# Altium schematic sheet USB_UART.SchDoc
size A4; SheetNumber: 1; SheetTotal: 4
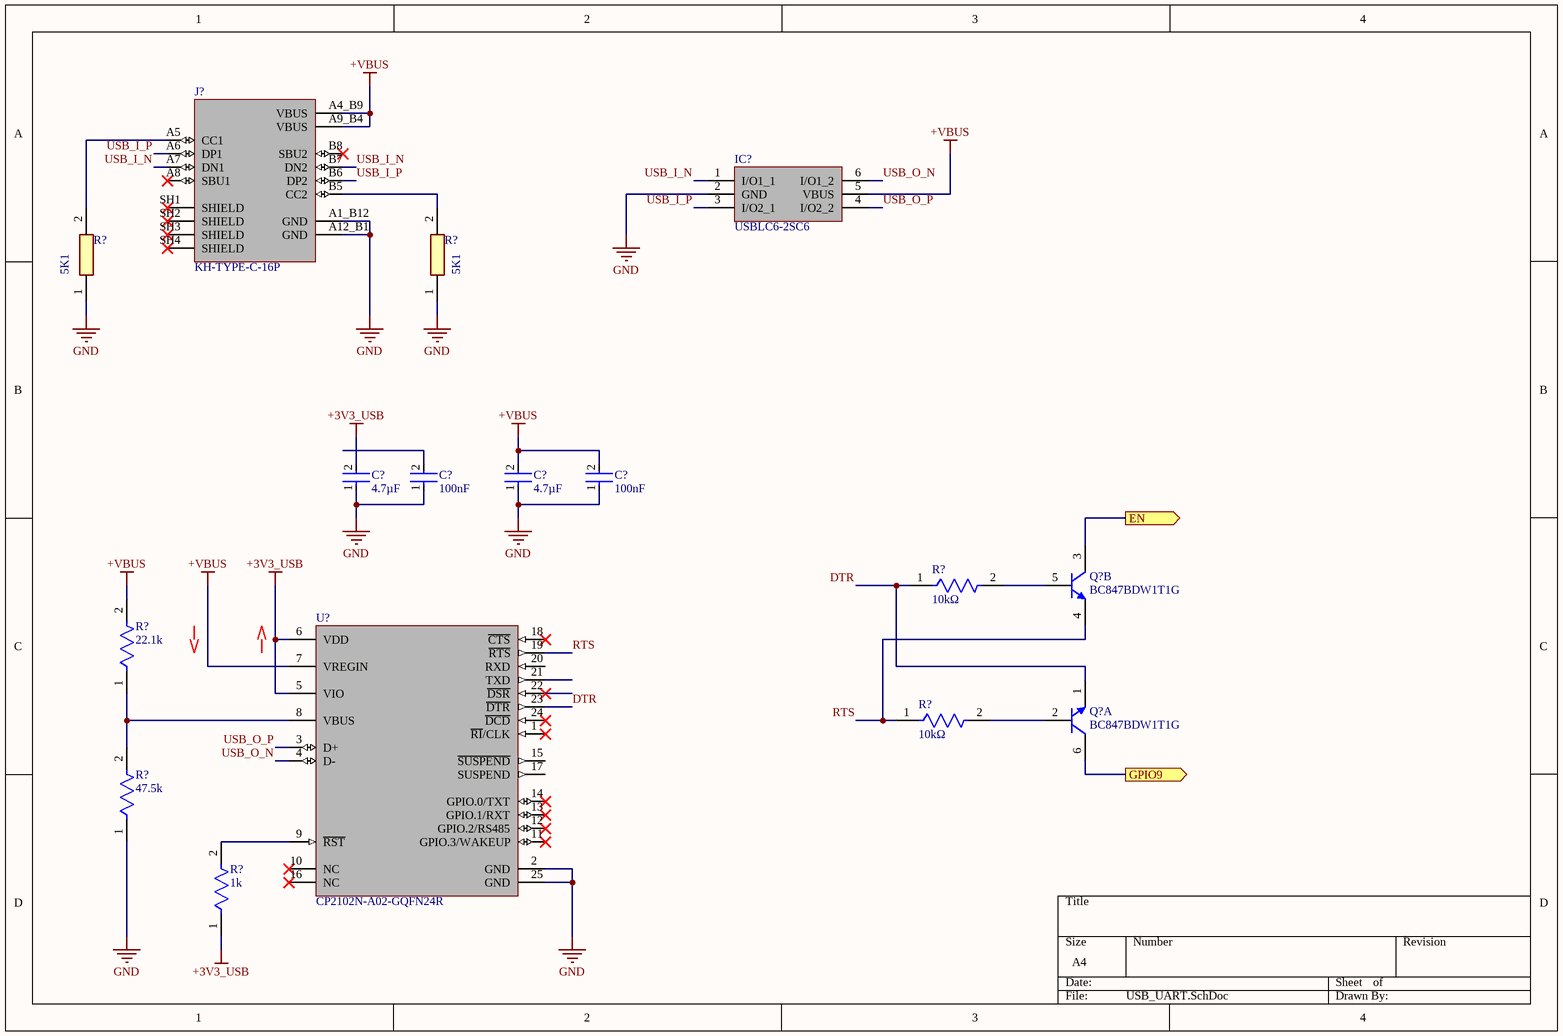
[diagram p0: USB_UART.SchDoc]

## Parts
(Parts that share a designator on the sheet are numbered #1, #2 ... from top to bottom, then left to right.)
C?#1  4.7µF  [FP-CGB3B-MFG]
C?#2  100nF  [FP-CGA3E-0_3-0_1-IPC_A]
C?#3  4.7µF  [FP-CGB3B-MFG]
C?#4  100nF  [FP-CGA3E-0_3-0_1-IPC_A]
IC?  USBLC6-2SC6  [Tech Public SOT23-6]
J?  KH-TYPE-C-16P  [KINGHELM_KH-TYPE-C-16P]
Q?#1  BC847BDW1T1G  [ONSC-SOT-363-6-419B-02_W_V]  (part B of 2)
Q?#2  BC847BDW1T1G  [ONSC-SOT-363-6-419B-02_W_V]  (part A of 2)
R?#1  5K1  [RESC1608X55N]
R?#2  5K1  [RESC1608X55N]
R?#3  10kΩ  [FP-RC0603-0_55-IPC_C]
R?#4  22.1k  [FP-AC0603-IPC_B]
R?#5  10kΩ  [FP-RC0603-0_55-IPC_C]
R?#6  47.5k  [FP-AC0603-IPC_B]
R?#7  1k  [FP-AC0603-IPC_B]
U?  CP2102N-A02-GQFN24R  [FP-CP2102N-A02-GQFN24R-IPC_C]

## Ports
EN (out), GPIO9 (out)

## Nets
+3V3_USB: C?#1.2 R?#7.1 U?.5(VIO) U?.6(VDD)
+VBUS: C?#3.2 C?#4.2 IC?.5(VBUS) J?.A4_B9(VBUS) J?.A9_B4(VBUS) R?#4.2 U?.7(VREGIN)
GND: C?#1.1 C?#2.1 C?#3.1 C?#4.1 IC?.2(GND) J?.A1_B12(GND) J?.A12_B1(GND) R?#1.1 R?#2.1 R?#6.1 U?.2(GND) U?.25(GND)
DTR: Q?#2.1(E) R?#3.1 U?.23(~{DTR})
EN: Q?#1.3(C) ; port EN
GPIO9: Q?#2.6(C) ; port GPIO9
RTS: Q?#1.4(E) R?#5.1 U?.19(~{RTS})
USB_I_N: IC?.1(I/O1_1) J?.A7(DN1) J?.B7(DN2)
USB_I_P: IC?.3(I/O2_1) J?.A6(DP1) J?.B6(DP2)
USB_O_N: IC?.6(I/O1_2) U?.4(D-)
USB_O_P: IC?.4(I/O2_2) U?.3(D+)
NetJ?_A5: J?.A5(CC1) R?#1.2
NetJ?_B5: J?.B5(CC2) R?#2.2
NetQ?#1_5: Q?#1.5(B) R?#3.2
NetQ?#2_2: Q?#2.2(B) R?#5.2
NetR?#4_1: R?#4.1 R?#6.2 U?.8(VBUS)
NetR?#7_2: R?#7.2 U?.9(~{RST})

Not connected (* = marked no-connect by the designer): C?#2 2; J? A8(SBU1)* B8(SBU2)* SH1(SHIELD)* SH2(SHIELD)* SH3(SHIELD)* SH4(SHIELD)*; U? 1(~{RI}/CLK)* 10(NC)* 11(GPIO.3/WAKEUP)* 12(GPIO.2/RS485)* 13(GPIO.1/RXT)* 14(GPIO.0/TXT)* 15(~{SUSPEND}) 16(NC)* 17(SUSPEND) 18(~{CTS})* 20(RXD) 21(TXD) 22(~{DSR})* 24(~{DCD})*

## Library data of the parts
C?#1 C?#3 = CMP-08246-002692-1: CAP CER 4.7UF 10V X5R 0603; Tolerance: 10%; Mount: Surface Mount; Weight: 7.1E-05oz; Case Code (Metric): 1608; Thickness: 0.022inch; Voltage Rating: 10V; Termination: SMD/SMT; Min Operating Temperature: -55°C; Package Quantity: 1; Case/Package: 0603; Capacitance: 4.7uF; RoHS Compliant: Yes; Packaging: Tape and Reel; Max Operating Temperature: 85°C; Width: 0.031inch; Series: CGB; Height: 0.55mm; Dielectric: X5R; Depth: 0.8mm; Case Code (Imperial): 0603; Length: 1.6mm; Lead Free: Lead Free; Voltage Rating (DC): 10V
C?#2 C?#4 = CMP-2000-07546-2: Cap Ceramic 100nF 50V X7R 10% Pad SMD 0603 +125°C Automotive T/R; Weight: 7.1E-05oz; Composition: Ceramic; Max Operating Temperature: 125°C; Termination: SMD/SMT; Dielectric: X7R; Length: 1.6mm; Package Quantity: 1; REACH SVHC: No SVHC; Lead Free: Lead Free; Case Code (Metric): 1608; Min Operating Temperature: -55°C; Packaging: Tape and Reel; Tolerance: 10%; Voltage Rating: 50V; Case Code (Imperial): 0603; Capacitance: 100nF; Case/Package: 0603; Voltage Rating (DC): 50V; Depth: 0.8mm; Radiation Hardening: No; Ratings: AEC-Q200; Mount: Surface Mount; Voltage: 50V; Thickness: 0.035inch; Width: 0.8mm; Height: 0.8mm
IC? = Tech Public USBLC6-2SC6: Integrated Circuit; Height: 1.45mm; Manufacturer_Name: Tech Public; Manufacturer_Part_Number: USBLC6-2SC6; Mouser Part Number: 511-USBLC6-2SC6; Arrow Part Number: USBLC6-2SC6; Arrow Price/Stock: https://www.arrow.com/en/products/usblc6-2sc6/stmicroelectronics?region=nac
J? = KH-TYPE-C-16P: MF: kinghelm; Value: *; SnapEDA_Link: https://www.snapeda.com/parts/KH-TYPE-C-16P/Ki/view-part/?ref=snap; MP: KH-TYPE-C-16P; Check_prices: https://www.snapeda.com/parts/KH-TYPE-C-16P/Ki/view-part/?ref=eda; Availability: Not in stock; Price: None; Package: None
Q?#1 Q?#2 = CMP-1048-00875-1: Dual General Purpose Transistors, NPN, 6-Pin SOT-363, Pb-Free, Tape and Reel; Manufacturer: On Semiconductor; fT Min (MHz): 100; IC Continuous (A): 0.1; Polarity: Dual NPN; ComponentLink3Description: Package Specification; PackageReference: SOT-363-6-419B-02_W; RoHS: TRUE; PackageVersion: Rev. W, 01/2006; Packing: Tape and Reel; Mounting Technology: Surface Mount; ComponentLink3URL: http://www.onsemi.com/pub_link/Collateral/NTJD4001N-D.PDF; ComponentLink2URL: http://www.onsemi.cn/pub_link/Collateral/BC846BDW1T1-D.PDF; ComponentLink2Description: Datasheet; ComponentLink1Description: Manufacturer URL; PartNumber: BC847BDW1T1G; DatasheetVersion: Rev. 9; PackageDescription: 6-Pin Small Outline Transistor, Body 2 x 1.25 mm, Pitch 0.65 mm; ComponentLink1URL: http://www.onsemi.com/
R?#1 R?#2 = 0603WAF5101T5E: Resistor; Manufacturer_Name: UNI-ROYAL(Uniroyal Elec); Datasheet Link: https://datasheet.lcsc.com/szlcsc/Uniroyal-Elec-0603WAF5101T5E_C23186.pdf; Height: 0.55mm; Manufacturer_Part_Number: 0603WAF5101T5E
R?#3 R?#5 = CMP-2100-03664-2: RES 10K OHM 1% 1/10W 0603; Voltage Rating: 75V; Voltage Rating (DC): 50V; Resistance: 10kR; Power Rating: 100mW; Temperature Coefficient: 100ppm/°C; Depth: 0.8mm; Termination: SMD/SMT; Resistor Type: Thick Film; Series: RC; Construction: Rectangular; Features: Moisture Resistant; Packaging: Tape and Reel; Min Operating Temperature: -55°C; Number of Terminations: 2; Lead Pitch: 0.3mm; RoHS Compliant: Yes; Case/Package: 0603; Resistance Tolerance: 1%; Military Standard: Not; Weight: 7.1E-05oz; Number of Pins: 2; Tolerance: 1%; Length: 1.6mm; Case Code (Imperial): 0603; Lead Free: Lead Free; Width: 0.8mm; Max Power Dissipation: 100mW; Height: 0.45mm; Max Operating Temperature: 155°C; Case Code (Metric): 1608; Size Code: 0603
R?#4 = CMP-2000-04828-3: RES 22.1kΩ 1.00% 0.1W 0603; Voltage Rating: 50V; Power Rating: 100mW; Tolerance: 1%; Temperature Coefficient: 100ppm/°C; Depth: 0.8mm; Case/Package: 0603; Size Code: 0603; Case Code (Metric): 1608; Height: 0.022inch; Series: AC; Width: 0.031inch; Construction: Rectangular; Length: 0.063inch; Case Code (Imperial): 0603; Package Quantity: 1; RoHS Compliant: Yes; Features: Moisture Resistant; Resistor Type: Thick Film; Max Power Dissipation: 100mW; Packaging: Tape and Reel; Termination: SMD/SMT; Ratings: AEC-Q200; Max Operating Temperature: 155°C; Min Operating Temperature: -55°C; Military Standard: Not; Lead Free: Lead Free; Number of Terminations: 2
R?#6 R?#7 = CMP-2000-04828-3: RES 47.5kΩ 1.00% 0.1W 0603; Voltage Rating: 50V; Power Rating: 100mW; Tolerance: 1%; Temperature Coefficient: 100ppm/°C; Depth: 0.8mm; Case/Package: 0603; Size Code: 0603; Case Code (Metric): 1608; Height: 0.022inch; Series: AC; Width: 0.031inch; Construction: Rectangular; Length: 0.063inch; Case Code (Imperial): 0603; Package Quantity: 1; RoHS Compliant: Yes; Features: Moisture Resistant; Resistor Type: Thick Film; Max Power Dissipation: 100mW; Packaging: Tape and Reel; Termination: SMD/SMT; Ratings: AEC-Q200; Max Operating Temperature: 155°C; Min Operating Temperature: -55°C; Military Standard: Not; Lead Free: Lead Free; Number of Terminations: 2
U? = Skyworks CP2102N-A02-GQFN24R: IC USB TO UART BRIDGE QFN24; Manufacturer Lifecycle Status: FULL PRODUCTION; NexarPartId: 99772192; Max Junction Temperature (Tj): 105°C; Min Supply Voltage: 1.71V; Max Supply Voltage: 3.6V; Number of Digital IO: 4; Interface: I2C, RS-485, UART, USB; Lifecycle Status: Production; Min Operating Temperature: -40°C; Height: 800µm; Ambient Temperature Range High: 85°C; Schedule B: 8542390000, 8542390000|8542390000|8542390000|8542390000|8542390000; Max Operating Temperature: 85°C